# Altium schematic sheet 02-碰撞模块-原理图.SchDoc
size A4
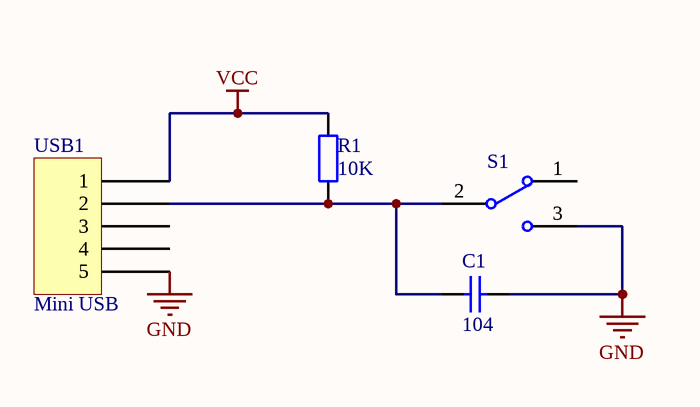
[diagram p0: 02-碰撞模块-原理图.SchDoc]

## Parts
C1  value 104  [0805]  (hidden comment: Cap)
R1  value 10K  [0805]  (hidden comment: Res2)
S1  SW-SPDT  [key]  (value not drawn)
USB1  Mini USB  [USB/SM0.8-6H5]

## Nets
GND: C1.1 S1.3 USB1.5
VCC: R1.1 USB1.1
NetC1_2: C1.2 R1.2 S1.2 USB1.2

Not connected (* = marked no-connect by the designer): S1 1; USB1 3 4

## Library data of the parts
C1 = Cap: Capacitor; Published: 8-Jun-2000; LatestRevisionDate: 17-Jul-2002; LatestRevisionNote: Re-released for DXP Platform.; PackageReference: RAD-0.3; Publisher: Altium Limited
R1 = Res2: Resistor; Published: 8-Jun-2000; LatestRevisionDate: 17-Jul-2002; LatestRevisionNote: Re-released for DXP Platform.; PackageReference: AXIAL-0.4; Publisher: Altium Limited
S1 = SW-SPDT: SPDT Subminiature Toggle Switch, Right Angle Mounting, Vertical Actuation; Published: 24-Mar-1999; LatestRevisionDate: 17-Dec-2003; LatestRevisionNote: Schematic revised, PCB Footprint replaced.; DatasheetVersion: 05-Dec-2000; PackageReference: TL36WW15050; Publisher: Altium Limited; ComponentLink1Description: Manufacturer Link; ComponentLink1URL: http://www.apem.com